# Altium schematic sheet Capteur IR.SchDoc: Capteurs IR
size Letter; Author: AC/KC; Engineer: k.cotton; Organization: Cegep Limoilou; Address1: 1300, 8e Avenue; Address2: Québec, QC; Address3: Canada; Address4: G1J 5L5; SheetNumber: 1; SheetTotal: 1
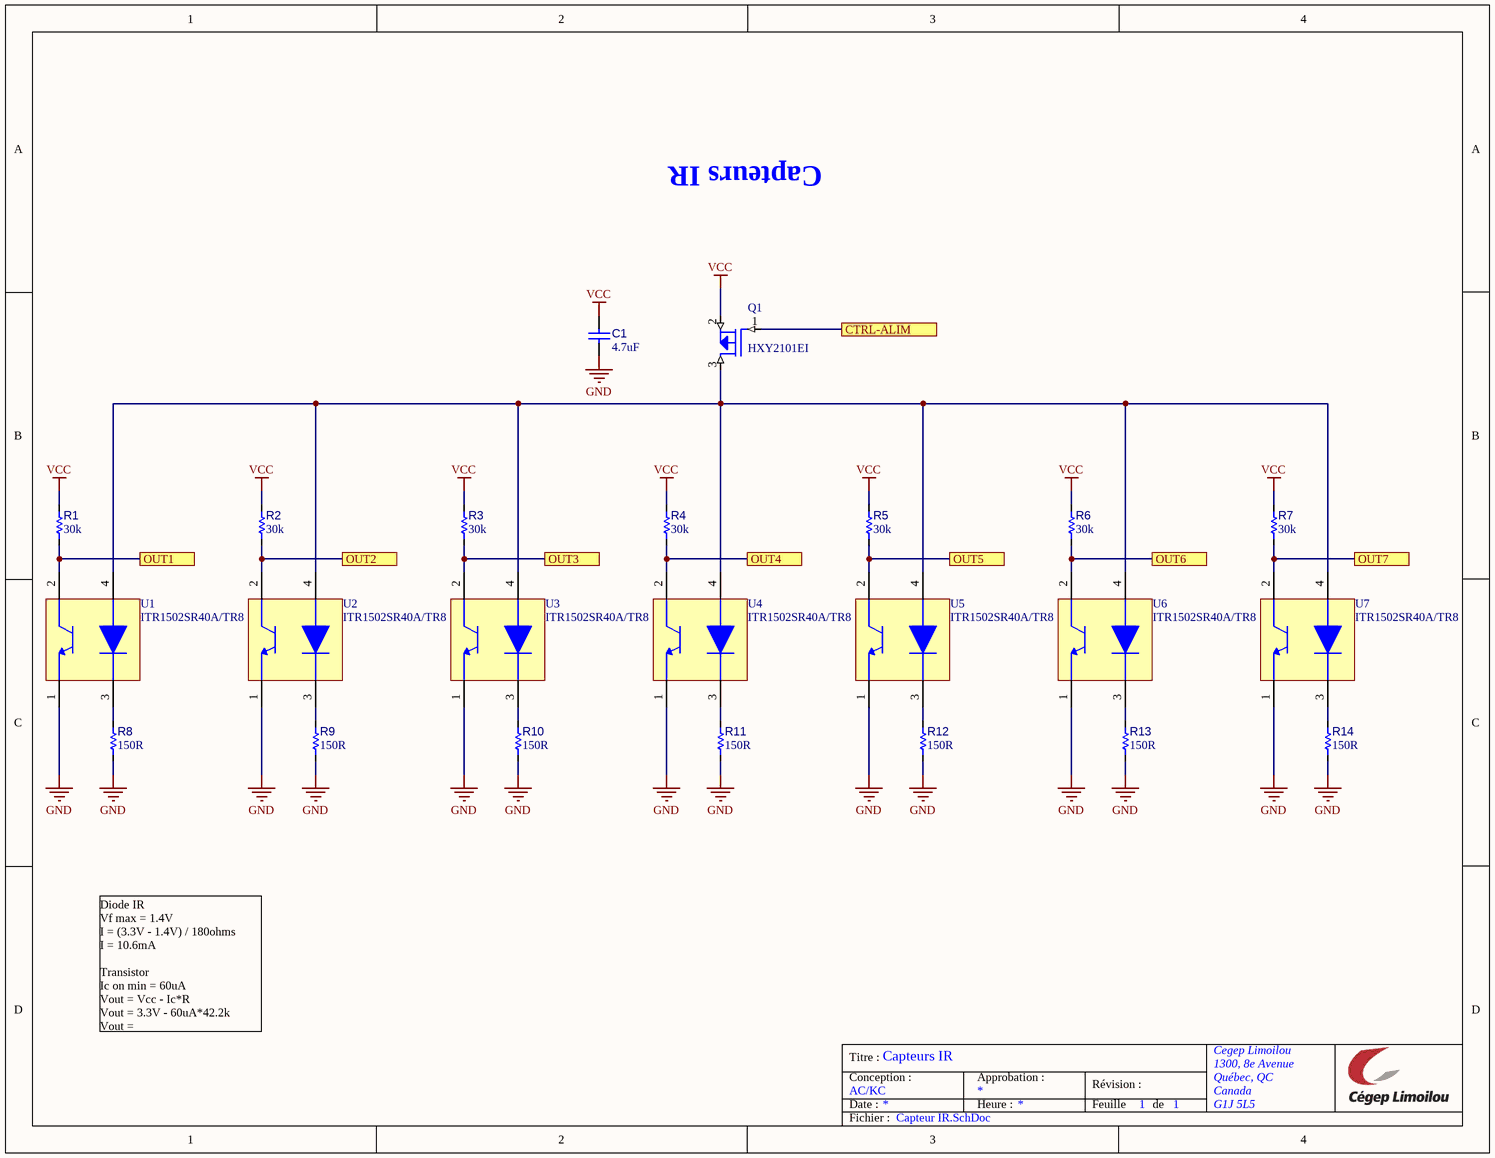
[diagram p0: Capteur IR.SchDoc]

## Parts
C1  value 4.7uF  [C_2012[0805]]  (hidden comment: CAP CER 4.7uF 25V X7R 0805)
Q1  HXY2101EI  [SOT-323]
R1  value 30k  [R_1608[0603]]  (hidden comment: Res 30k 1% 0603)
R2  value 30k  [R_1608[0603]]  (hidden comment: Res 30k 1% 0603)
R3  value 30k  [R_1608[0603]]  (hidden comment: Res 30k 1% 0603)
R4  value 30k  [R_1608[0603]]  (hidden comment: Res 30k 1% 0603)
R5  value 30k  [R_1608[0603]]  (hidden comment: Res 30k 1% 0603)
R6  value 30k  [R_1608[0603]]  (hidden comment: Res 30k 1% 0603)
R7  value 30k  [R_1608[0603]]  (hidden comment: Res 30k 1% 0603)
R8  value 150R  [R_3216[1206]]  (hidden comment: Res 150R 5% 1206)
R9  value 150R  [R_3216[1206]]  (hidden comment: Res 150R 5% 1206)
R10  value 150R  [R_3216[1206]]  (hidden comment: Res 150R 5% 1206)
R11  value 150R  [R_3216[1206]]  (hidden comment: Res 150R 5% 1206)
R12  value 150R  [R_3216[1206]]  (hidden comment: Res 150R 5% 1206)
R13  value 150R  [R_3216[1206]]  (hidden comment: Res 150R 5% 1206)
R14  value 150R  [R_3216[1206]]  (hidden comment: Res 150R 5% 1206)
U1  ITR1502SR40A/TR8  [GP2S700HCP]
U2  ITR1502SR40A/TR8  [GP2S700HCP]
U3  ITR1502SR40A/TR8  [GP2S700HCP]
U4  ITR1502SR40A/TR8  [GP2S700HCP]
U5  ITR1502SR40A/TR8  [GP2S700HCP]
U6  ITR1502SR40A/TR8  [GP2S700HCP]
U7  ITR1502SR40A/TR8  [GP2S700HCP]

## Ports
CTRL-ALIM, OUT1, OUT2, OUT3, OUT4, OUT5, OUT6, OUT7

## Nets
GND: C1.1 R8.1 R9.1 R10.1 R11.1 R12.1 R13.1 R14.1 U1.1(E) U2.1(E) U3.1(E) U4.1(E) U5.1(E) U6.1(E) U7.1(E)
VCC: C1.2 Q1.2(SOURCE) R1.2 R2.2 R3.2 R4.2 R5.2 R6.2 R7.2
CTRL-ALIM: Q1.1(GATE) ; port CTRL-ALIM
OUT1: R1.1 U1.2(C) ; port OUT1
OUT2: R2.1 U2.2(C) ; port OUT2
OUT3: R3.1 U3.2(C) ; port OUT3
OUT4: R4.1 U4.2(C) ; port OUT4
OUT5: R5.1 U5.2(C) ; port OUT5
OUT6: R6.1 U6.2(C) ; port OUT6
OUT7: R7.1 U7.2(C) ; port OUT7
NetQ1_3: Q1.3(DRAIN) U1.4(A) U2.4(A) U3.4(A) U4.4(A) U5.4(A) U6.4(A) U7.4(A)
NetR8_2: R8.2 U1.3(K)
NetR9_2: R9.2 U2.3(K)
NetR10_2: R10.2 U3.3(K)
NetR11_2: R11.2 U4.3(K)
NetR12_2: R12.2 U5.3(K)
NetR13_2: R13.2 U6.3(K)
NetR14_2: R14.2 U7.3(K)

## Notes on the sheet
- Diode IR
  Vf max = 1.4V
  I = (3.3V - 1.4V) / 180ohms
  I = 10.6mA
  Transistor
  Ic on min = 60uA
  Vout = Vcc - Ic*R
  Vout = 3.3V - 60uA*42.2k
  Vout =
- Titre :
- Conception :
- Date :
- Approbation :
- Heure :
- Révision :
- Feuille
- de
- Fichier :

## Library data of the parts
C1 = CAP003: Capacitor type 1; Manufacturer 1: Taiyo Yuden; Manufacturer Part Number 1: TMK212AB7475KG-T; LibRef: CAP003; Code CEGEP: KCOND02SM; Tolerance: 10%; Rated Voltage: 25V; Dielectric: X7R; Mounting Technology: SMT; Supplier 1: LCSC; Supplier Part Number 1: C163186
Q1 = Q_PMOS-20V-1.8A: MOSFET P-CH 20V 1.8A SOT-323; Manufacturer 1: HXY Mosfet; Manufacturer Part Number 1: HXY2101EI; Supplier 1: LCSC; Supplier Part Number 1: C5148643; Manufacturer 2: MCC; Manufacturer Part Number 2: SI2101A-TP; Supplier 2: Digikey; Supplier Part Number 2: 353-SI2101A-TPCT-ND; Mounting Technology: SMT
R1-R7 = RES030: Resistor type 1; Manufacturer 1: Yageo; Manufacturer Part Number 1: RC0603FR-0730KL; LibRef: RES030; Puissance: 1/10W; Max Working Voltage: 75V; Tolerance: 1%; Mounting Technology: SMT; Supplier 1: LCSC; Supplier Part Number 1: C100001
R8-R14 = RES042: Resistor type 1; LibRef: RES042; Code CEGEP: RESI0045SMT; Localisation: AV-P24--R14-J04; Puissance: 1/4W; Max Working Voltage: 200V; Tolerance: 5%; Mounting Technology: SMT
U1-U7 = U_ITR1502SR40A/TR8: PHOTOINTERRUPTER REFLECTIVE 3MM SMD; Manufacturer 1: Everlight; Manufacturer Part Number 1: ITR1502SR40A/TR8; Supplier 1: LCSC; Supplier Part Number 1: C183793; Manufacturer 2: Sharp; Manufacturer Part Number 2: GP2S700HCP; Supplier 2: Digikey; Supplier Part Number 2: 1855-1020-1-ND; Mounting Technology: SMT